# EAGLE schematic lcd-i2c (EAGLE 7.6.0)
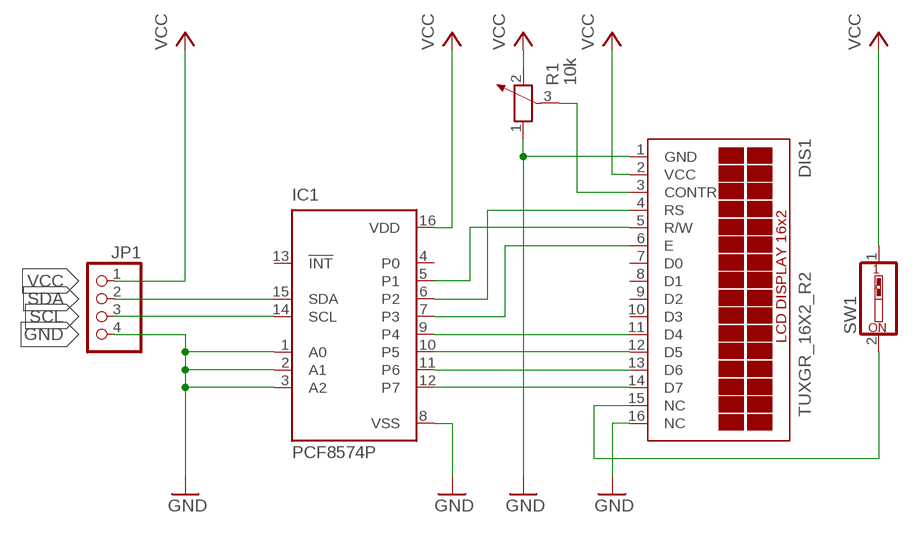
[diagram p0: schematic, sheet 1]

## Parts
DIS1  TUXGR_16X2_R2  [TUXGR_16X2_R2]
IC1  PCF8574P  [DIL16]
JP1  PINHD-1X4/90  [1X04/90]
R1  10k  POTENTIOMETER_PT-10S  [PT-10S]
SW1  SW_DIP-1  [EDG-01]

## Nets
GND: DIS1.1(GND) DIS1.16(NC) IC1.1(A0) IC1.2(A1) IC1.3(A2) IC1.8(VSS) JP1.4 R1.1
N$3: DIS1.13(D6) IC1.11(P6)
N$4: DIS1.15(NC) SW1.2
N$5: DIS1.14(D7) IC1.12(P7)
N$6: DIS1.12(D5) IC1.10(P5)
N$7: DIS1.11(D4) IC1.9(P4)
N$8: DIS1.6(E) IC1.7(P3)
N$9: DIS1.5(R/W) IC1.5(P1)
N$10: DIS1.4(RS) IC1.6(P2)
N$11: DIS1.3(CONTR) R1.3
SCL: IC1.14(SCL) JP1.3
SDA: IC1.15(SDA) JP1.2
VCC: DIS1.2(VCC) IC1.16(VDD) JP1.1 R1.2 SW1.1
Unconnected: DIS1.7(D0) DIS1.8(D1) DIS1.9(D2) DIS1.10(D3) IC1.4(P0) IC1.13(!INT)

## Library data of the parts
DIS1 = display-lcd:TUXGR_16X2_R2: Tuxgraphics LCD display 16x2 characters reflective, without background light Source: tuxgr_12x2_r2.pdf; OC_FARNELL: unknown; OC_NEWARK: unknown
IC1 = micro-philips:PCF8574: I2C-Bus Remote 8-bit I/O expander http://www.semiconductors.philips.com/acrobat_download/datasheets/PCF8574_4.pdf; MPN: PCF8574PN; OC_FARNELL: 204020; OC_NEWARK: 11N8515
JP1 = pinhead:PINHD-1X4: PIN HEADER
R1 = rcl:POTENTIOMETER_: Potentiometer
SW1 = special:SW_DIP-1: DIP SWITCH